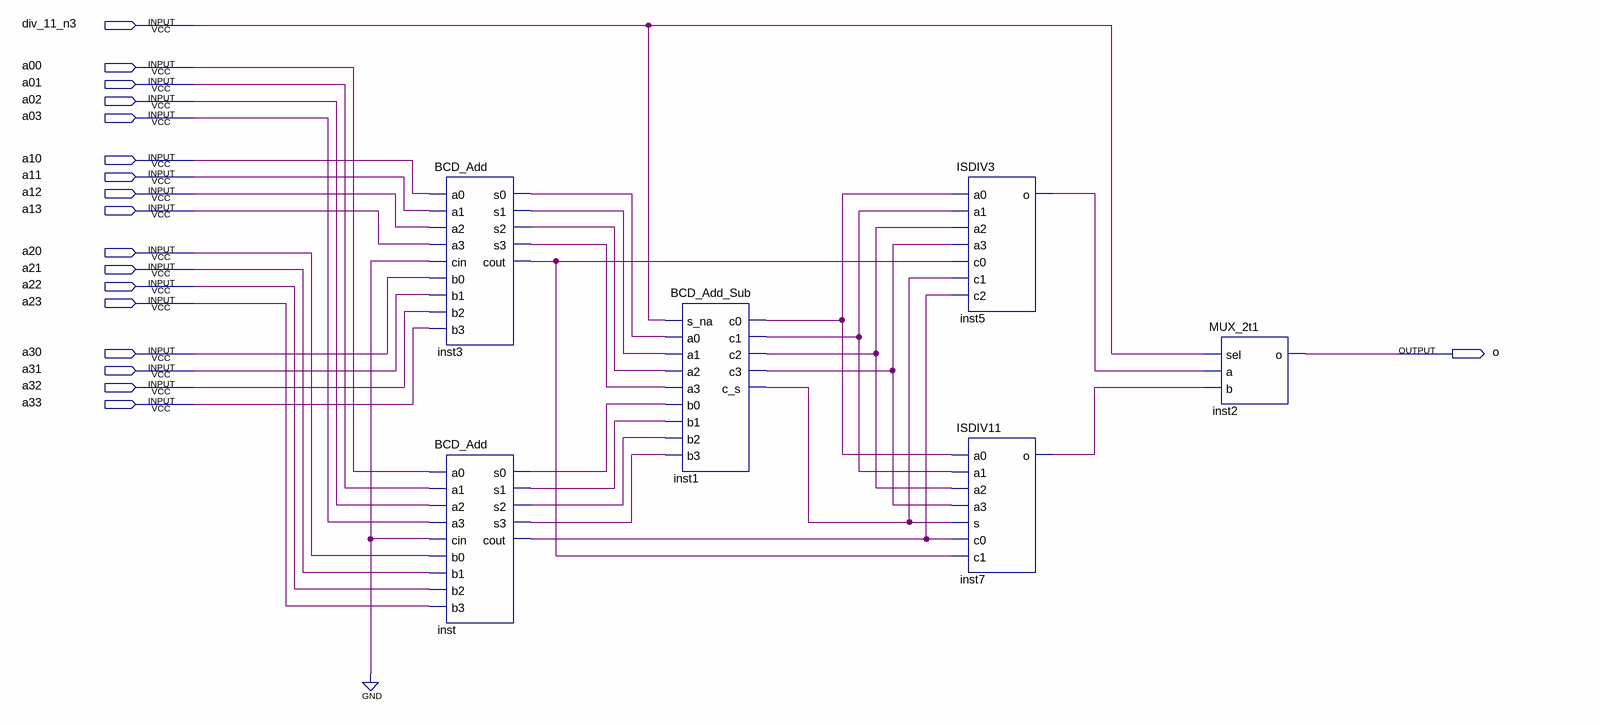
[diagram p0: schematic sheet]
// Quartus schematic Main.bdf as structural Verilog: 6 symbols, 18 pins
module Main (
  input  div_11_n3,
  input  a00,
  input  a01,
  input  a02,
  input  a03,
  input  a10,
  input  a11,
  input  a12,
  input  a13,
  input  a20,
  input  a21,
  input  a22,
  input  a23,
  input  a30,
  input  a31,
  input  a32,
  input  a33,
  output o
);

  wire inst1_c0, inst1_c1, inst1_c2, inst1_c3, inst1_c_s, inst3_cout, inst3_s0, inst3_s1, inst3_s2, inst3_s3,
       inst5_o, inst7_o, inst_cout, inst_s0, inst_s1, inst_s2, inst_s3;

  BCD_Add inst3 (
    .a0(a10), .a1(a11), .a2(a12), .a3(a13), .cin(1'b0), .b0(a30), .b1(a31), .b2(a32), .b3(a33),
    .s0(inst3_s0), .s1(inst3_s1), .s2(inst3_s2), .s3(inst3_s3), .cout(inst3_cout));
  BCD_Add inst (
    .a0(a00), .a1(a01), .a2(a02), .a3(a03), .cin(1'b0), .b0(a20), .b1(a21), .b2(a22), .b3(a23), .s0(inst_s0),
    .s1(inst_s1), .s2(inst_s2), .s3(inst_s3), .cout(inst_cout));
  BCD_Add_Sub inst1 (
    .s_na(div_11_n3), .a0(inst3_s0), .a1(inst3_s1), .a2(inst3_s2), .a3(inst3_s3), .b0(inst_s0), .b1(inst_s1),
    .b2(inst_s2), .b3(inst_s3), .c0(inst1_c0), .c1(inst1_c1), .c2(inst1_c2), .c3(inst1_c3), .c_s(inst1_c_s));
  ISDIV3 inst5 (
    .a0(inst1_c0), .a1(inst1_c1), .a2(inst1_c2), .a3(inst1_c3), .c0(inst3_cout), .c1(inst1_c_s),
    .c2(inst_cout), .o(inst5_o));
  ISDIV11 inst7 (
    .a0(inst1_c0), .a1(inst1_c1), .a2(inst1_c2), .a3(inst1_c3), .s(inst1_c_s), .c0(inst_cout),
    .c1(inst3_cout), .o(inst7_o));
  MUX_2t1 inst2 (.sel(div_11_n3), .a(inst5_o), .b(inst7_o), .o(o));
endmodule
